# EAGLE design RPiLPC1114FDH28 (EAGLE 7.5.0)
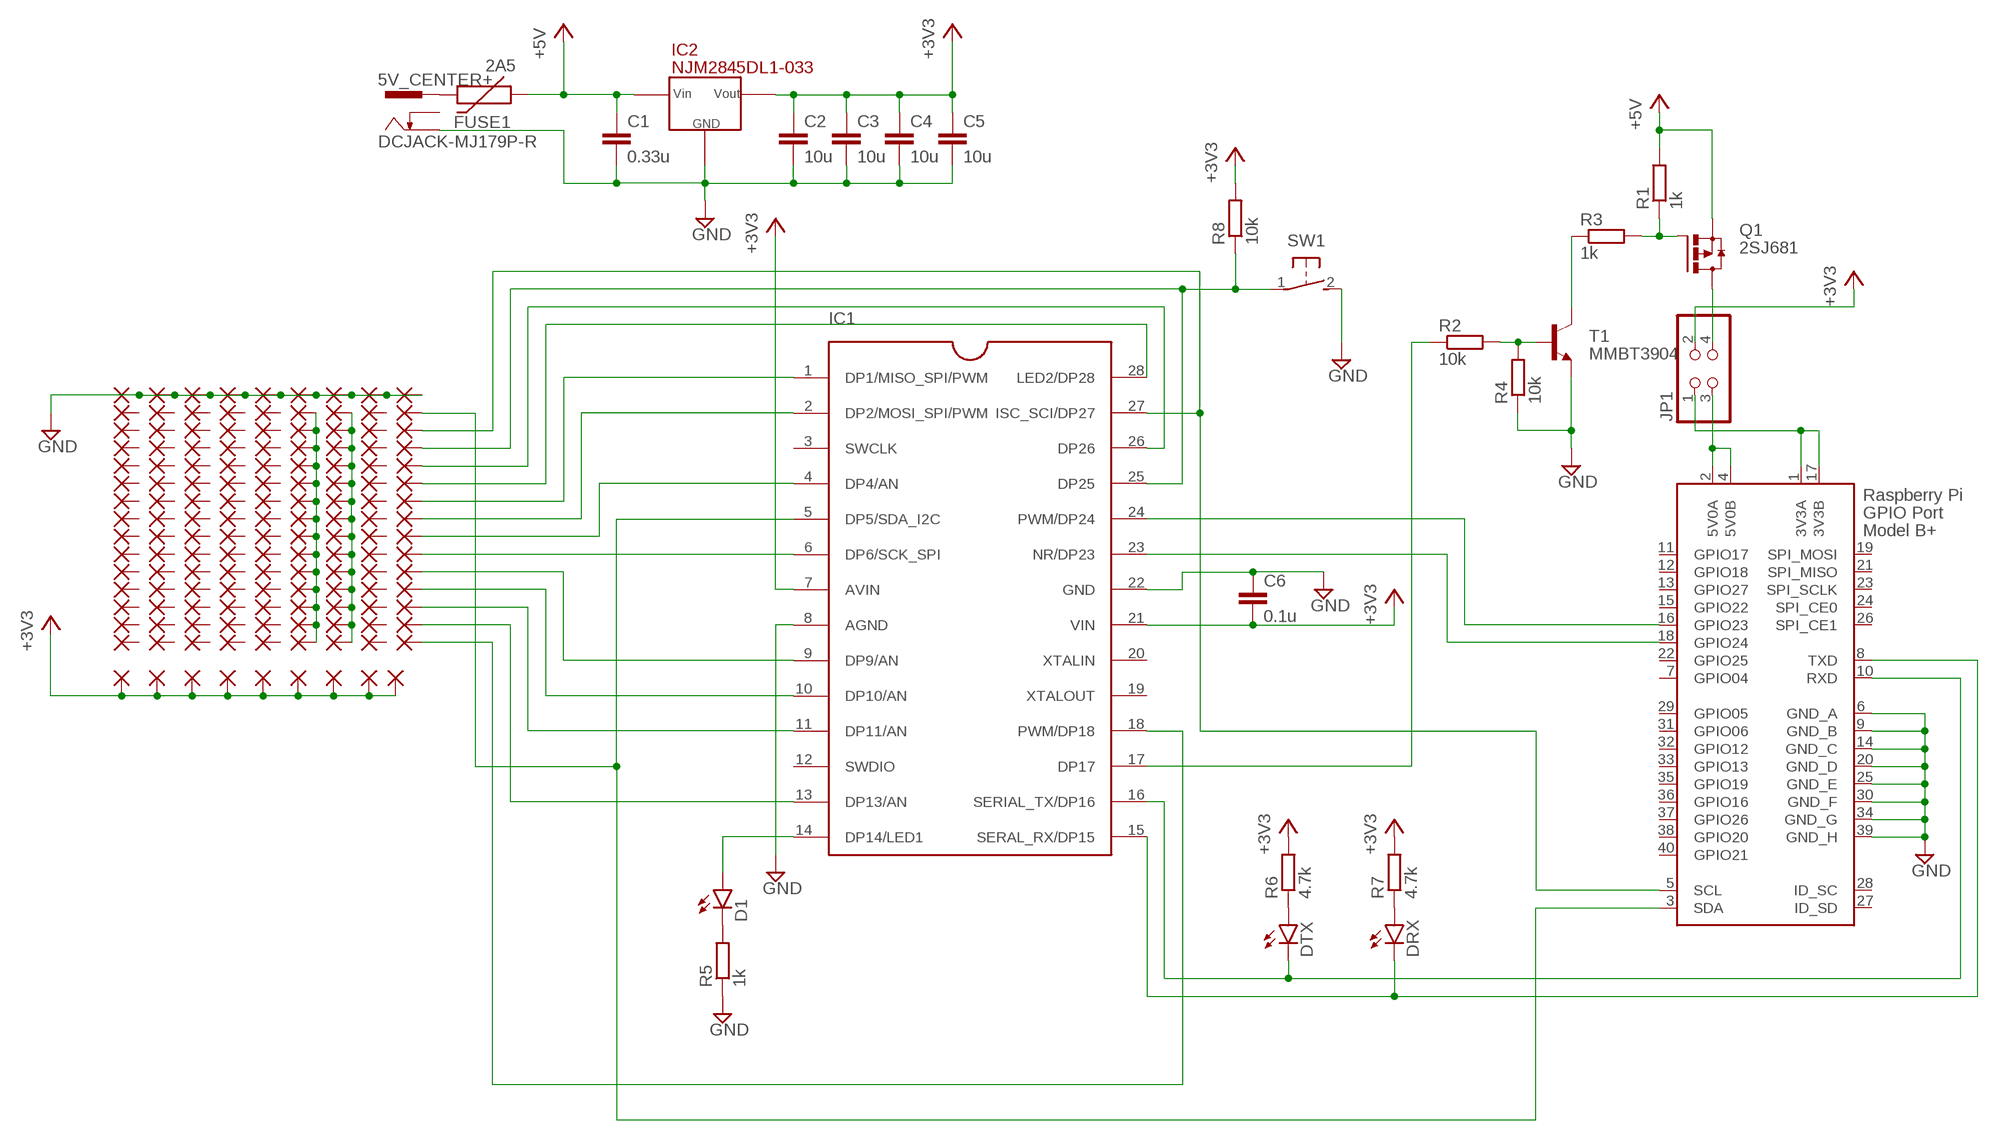
[diagram p0: schematic, sheet 1]

## Parts
5V_CENTER+  DCJACK-MJ179P-R  [MJ-179P-R]
C1  0.33u  C-EUC0603  [C0603]
C2  10u  C-EUC0805  [C0805]
C3  10u  C-EUC0805  [C0805]
C4  10u  C-EUC0805  [C0805]
C5  10u  C-EUC0805  [C0805]
C6  0.1u  C-EUC0603  [C0603]
D1  LED0603  [LED-0603]
DRX  LED0603  [LED-0603]
DTX  LED0603  [LED-0603]
FUSE1  2A5  PTCPTH  [PTC]
IC1  LPC1114DH28  [TSSOP28]
IC2  NJM2845DL1-033  NJM2845DL1  [TO-252-3]
JP1  PINHD-2X2  [2X02]
PAD1  WIREPAD1,6/0,8  [1,6/0,8]
PAD2  WIREPAD1,6/0,8  [1,6/0,8]
PAD3  WIREPAD1,6/0,8  [1,6/0,8]
PAD4  WIREPAD1,6/0,8  [1,6/0,8]
PAD5  WIREPAD1,6/0,8  [1,6/0,8]
PAD6  WIREPAD1,6/0,8  [1,6/0,8]
PAD7  WIREPAD1,6/0,8  [1,6/0,8]
PAD8  WIREPAD1,6/0,8  [1,6/0,8]
PAD9  WIREPAD1,6/0,8  [1,6/0,8]
PAD10  WIREPAD1,6/0,8  [1,6/0,8]
PAD11  WIREPAD1,6/0,8  [1,6/0,8]
PAD12  WIREPAD1,6/0,8  [1,6/0,8]
PAD13  WIREPAD1,6/0,8  [1,6/0,8]
PAD14  WIREPAD1,6/0,8  [1,6/0,8]
PAD15  WIREPAD1,6/0,8  [1,6/0,8]
PAD16  WIREPAD1,6/0,8  [1,6/0,8]
PAD17  WIREPAD1,6/0,8  [1,6/0,8]
PAD18  WIREPAD1,6/0,8  [1,6/0,8]
PAD19  WIREPAD1,6/0,8  [1,6/0,8]
PAD20  WIREPAD1,6/0,8  [1,6/0,8]
PAD21  WIREPAD1,6/0,8  [1,6/0,8]
PAD22  WIREPAD1,6/0,8  [1,6/0,8]
PAD23  WIREPAD1,6/0,8  [1,6/0,8]
PAD24  WIREPAD1,6/0,8  [1,6/0,8]
PAD25  WIREPAD1,6/0,8  [1,6/0,8]
PAD26  WIREPAD1,6/0,8  [1,6/0,8]
PAD27  WIREPAD1,6/0,8  [1,6/0,8]
PAD28  WIREPAD1,6/0,8  [1,6/0,8]
PAD29  WIREPAD1,6/0,8  [1,6/0,8]
PAD30  WIREPAD1,6/0,8  [1,6/0,8]
PAD31  WIREPAD1,6/0,8  [1,6/0,8]
PAD32  WIREPAD1,6/0,8  [1,6/0,8]
PAD33  WIREPAD1,6/0,8  [1,6/0,8]
PAD34  WIREPAD1,6/0,8  [1,6/0,8]
PAD35  WIREPAD1,6/0,8  [1,6/0,8]
PAD36  WIREPAD1,6/0,8  [1,6/0,8]
PAD37  WIREPAD1,6/0,8  [1,6/0,8]
PAD38  WIREPAD1,6/0,8  [1,6/0,8]
PAD39  WIREPAD1,6/0,8  [1,6/0,8]
PAD40  WIREPAD1,6/0,8  [1,6/0,8]
PAD41  WIREPAD1,6/0,8  [1,6/0,8]
PAD42  WIREPAD1,6/0,8  [1,6/0,8]
PAD43  WIREPAD1,6/0,8  [1,6/0,8]
PAD44  WIREPAD1,6/0,8  [1,6/0,8]
PAD45  WIREPAD1,6/0,8  [1,6/0,8]
PAD46  WIREPAD1,6/0,8  [1,6/0,8]
PAD47  WIREPAD1,6/0,8  [1,6/0,8]
PAD48  WIREPAD1,6/0,8  [1,6/0,8]
PAD49  WIREPAD1,6/0,8  [1,6/0,8]
PAD50  WIREPAD1,6/0,8  [1,6/0,8]
PAD51  WIREPAD1,6/0,8  [1,6/0,8]
PAD53  WIREPAD1,6/0,8  [1,6/0,8]
PAD54  WIREPAD1,6/0,8  [1,6/0,8]
PAD55  WIREPAD1,6/0,8  [1,6/0,8]
PAD56  WIREPAD1,6/0,8  [1,6/0,8]
PAD57  WIREPAD1,6/0,8  [1,6/0,8]
PAD58  WIREPAD1,6/0,8  [1,6/0,8]
PAD59  WIREPAD1,6/0,8  [1,6/0,8]
PAD60  WIREPAD1,6/0,8  [1,6/0,8]
PAD61  WIREPAD1,6/0,8  [1,6/0,8]
PAD62  WIREPAD1,6/0,8  [1,6/0,8]
PAD63  WIREPAD1,6/0,8  [1,6/0,8]
PAD64  WIREPAD1,6/0,8  [1,6/0,8]
PAD65  WIREPAD1,6/0,8  [1,6/0,8]
PAD66  WIREPAD1,6/0,8  [1,6/0,8]
PAD67  WIREPAD1,6/0,8  [1,6/0,8]
PAD69  WIREPAD1,6/0,8  [1,6/0,8]
PAD70  WIREPAD1,6/0,8  [1,6/0,8]
PAD71  WIREPAD1,6/0,8  [1,6/0,8]
PAD72  WIREPAD1,6/0,8  [1,6/0,8]
PAD73  WIREPAD1,6/0,8  [1,6/0,8]
PAD74  WIREPAD1,6/0,8  [1,6/0,8]
PAD75  WIREPAD1,6/0,8  [1,6/0,8]
PAD76  WIREPAD1,6/0,8  [1,6/0,8]
PAD77  WIREPAD1,6/0,8  [1,6/0,8]
PAD78  WIREPAD1,6/0,8  [1,6/0,8]
PAD79  WIREPAD1,6/0,8  [1,6/0,8]
PAD80  WIREPAD1,6/0,8  [1,6/0,8]
PAD81  WIREPAD1,6/0,8  [1,6/0,8]
PAD82  WIREPAD1,6/0,8  [1,6/0,8]
PAD83  WIREPAD1,6/0,8  [1,6/0,8]
PAD100  WIREPAD1,6/0,8  [1,6/0,8]
PAD101  WIREPAD1,6/0,8  [1,6/0,8]
PAD102  WIREPAD1,6/0,8  [1,6/0,8]
PAD103  WIREPAD1,6/0,8  [1,6/0,8]
PAD104  WIREPAD1,6/0,8  [1,6/0,8]
PAD105  WIREPAD1,6/0,8  [1,6/0,8]
PAD106  WIREPAD1,6/0,8  [1,6/0,8]
PAD107  WIREPAD1,6/0,8  [1,6/0,8]
PAD108  WIREPAD1,6/0,8  [1,6/0,8]
PAD109  WIREPAD1,6/0,8  [1,6/0,8]
PAD110  WIREPAD1,6/0,8  [1,6/0,8]
PAD112  WIREPAD1,6/0,8  [1,6/0,8]
PAD113  WIREPAD1,6/0,8  [1,6/0,8]
PAD114  WIREPAD1,6/0,8  [1,6/0,8]
PAD115  WIREPAD1,6/0,8  [1,6/0,8]
PAD117  WIREPAD1,6/0,8  [1,6/0,8]
PAD118  WIREPAD1,6/0,8  [1,6/0,8]
PAD119  WIREPAD1,6/0,8  [1,6/0,8]
PAD120  WIREPAD1,6/0,8  [1,6/0,8]
PAD121  WIREPAD1,6/0,8  [1,6/0,8]
PAD122  WIREPAD1,6/0,8  [1,6/0,8]
PAD123  WIREPAD1,6/0,8  [1,6/0,8]
PAD124  WIREPAD1,6/0,8  [1,6/0,8]
PAD126  WIREPAD1,6/0,8  [1,6/0,8]
PAD127  WIREPAD1,6/0,8  [1,6/0,8]
PAD128  WIREPAD1,6/0,8  [1,6/0,8]
PAD129  WIREPAD1,6/0,8  [1,6/0,8]
PAD130  WIREPAD1,6/0,8  [1,6/0,8]
PAD131  WIREPAD1,6/0,8  [1,6/0,8]
PAD133  WIREPAD1,6/0,8  [1,6/0,8]
PAD134  WIREPAD1,6/0,8  [1,6/0,8]
PAD135  WIREPAD1,6/0,8  [1,6/0,8]
PAD136  WIREPAD1,6/0,8  [1,6/0,8]
PAD137  WIREPAD1,6/0,8  [1,6/0,8]
PAD138  WIREPAD1,6/0,8  [1,6/0,8]
PAD140  WIREPAD1,6/0,8  [1,6/0,8]
PAD141  WIREPAD1,6/0,8  [1,6/0,8]
PAD142  WIREPAD1,6/0,8  [1,6/0,8]
PAD143  WIREPAD1,6/0,8  [1,6/0,8]
PAD144  WIREPAD1,6/0,8  [1,6/0,8]
PAD145  WIREPAD1,6/0,8  [1,6/0,8]
PAD147  WIREPAD1,6/0,8  [1,6/0,8]
PAD148  WIREPAD1,6/0,8  [1,6/0,8]
PAD149  WIREPAD1,6/0,8  [1,6/0,8]
PAD150  WIREPAD1,6/0,8  [1,6/0,8]
PAD151  WIREPAD1,6/0,8  [1,6/0,8]
PAD152  WIREPAD1,6/0,8  [1,6/0,8]
PAD-3V3  WIREPAD1,6/0,8  [1,6/0,8]
PAD-DP1  WIREPAD1,6/0,8  [1,6/0,8]
PAD-DP2  WIREPAD1,6/0,8  [1,6/0,8]
PAD-DP4  WIREPAD1,6/0,8  [1,6/0,8]
PAD-DP5/SDA  WIREPAD1,6/0,8  [1,6/0,8]
PAD-DP6  WIREPAD1,6/0,8  [1,6/0,8]
PAD-DP9  WIREPAD1,6/0,8  [1,6/0,8]
PAD-DP10  WIREPAD1,6/0,8  [1,6/0,8]
PAD-DP11  WIREPAD1,6/0,8  [1,6/0,8]
PAD-DP13  WIREPAD1,6/0,8  [1,6/0,8]
PAD-DP18  WIREPAD1,6/0,8  [1,6/0,8]
PAD-DP25  WIREPAD1,6/0,8  [1,6/0,8]
PAD-DP26  WIREPAD1,6/0,8  [1,6/0,8]
PAD-DP27/SCL  WIREPAD1,6/0,8  [1,6/0,8]
PAD-DP28  WIREPAD1,6/0,8  [1,6/0,8]
PAD_GND  WIREPAD1,6/0,8  [1,6/0,8]
Q1  2SJ681  [2-7J2B(TOSHIBA)]
R1  1k  R-EU_R0603  [R0603]
R2  10k  R-EU_R0603  [R0603]
R3  1k  R-EU_R0603  [R0603]
R4  10k  R-EU_R0603  [R0603]
R5  1k  R-EU_R0603  [R0603]
R6  4.7k  R-EU_R0603  [R0603]
R7  4.7k  R-EU_R0603  [R0603]
R8  10k  R-EU_R0603  [R0603]
SW1  SWITCH-TACTILESW  [SWITCH-TACTILE]
T1  MMBT3904  TRANSISTOR_NPNMMBT2222A  [SOT23-3]
X1  RASPI_GPIO_B+#_PIN  [RASPI_GPIO_B+_PIN]

## Nets
+3V3 [3V3]: C2.1 C3.1 C4.1 C5.1 C6.2 IC1.7(AVIN) IC1.21(VIN) IC2.VOUT JP1.2 PAD117.1(P) PAD118.1(P) PAD119.1(P) PAD120.1(P) PAD121.1(P) PAD122.1(P) PAD123.1(P) PAD124.1(P) PAD-3V3.1(P) R6.2 R7.2 R8.2
+5V [5V]: C1.1 FUSE1.P$1 IC2.VIN Q1.P$3(S) R1.2
GND [GND]: 5V_CENTER+.2 C1.2 C2.2 C3.2 C4.2 C5.2 C6.1 IC1.8(AGND) IC1.22(GND) IC2.GND PAD1.1(P) PAD10.1(P) PAD19.1(P) PAD28.1(P) PAD37.1(P) PAD53.1(P) PAD69.1(P) PAD100.1(P) PAD_GND.1(P) R4.1 R5.1 SW1.2 T1.2(E) X1.6(GND_A) X1.9(GND_B) X1.14(GND_C) X1.20(GND_D) X1.25(GND_E) X1.30(GND_F) X1.34(GND_G) X1.39(GND_H)
N$1: DRX.C IC1.15(SERAL_RX/DP15) X1.8(TXD)
N$2: IC1.2(DP2/MOSI_SPI/PWM) PAD-DP2.1(P)
N$3: IC1.5(DP5/SDA_I2C) PAD-DP5/SDA.1(P) X1.3(SDA)
N$4: IC1.27(ISC_SCI/DP27) PAD-DP27/SCL.1(P) X1.5(SCL)
N$5: R2.2 R4.2 T1.1(B)
N$6: R3.1 T1.3(C)
N$7: Q1.P$1(G) R1.1 R3.2
N$8 [TORPI]: JP1.3 X1.2(5V0A) X1.4(5V0B)
N$9 [5V]: 5V_CENTER+.1 FUSE1.P$2
N$10: IC1.23(NR/DP23) X1.18(GPIO24)
N$11: IC1.24(PWM/DP24) X1.16(GPIO23)
N$12: IC1.17(DP17) R2.1
N$13: D1.C R5.2
N$14: D1.A IC1.14(DP14/LED1)
N$15: DTX.A R6.1
N$16: DRX.A R7.1
N$17: DTX.C IC1.16(SERIAL_TX/DP16) X1.10(RXD)
N$18: IC1.1(DP1/MISO_SPI/PWM) PAD-DP1.1(P)
N$19: IC1.4(DP4/AN) PAD-DP4.1(P)
N$20: IC1.6(DP6/SCK_SPI) PAD-DP6.1(P)
N$21: IC1.13(DP13/AN) PAD-DP13.1(P)
N$22: IC1.11(DP11/AN) PAD-DP11.1(P)
N$23: IC1.10(DP10/AN) PAD-DP10.1(P)
N$24: IC1.9(DP9/AN) PAD-DP9.1(P)
N$25: IC1.18(PWM/DP18) PAD-DP18.1(P)
N$26: IC1.28(LED2/DP28) PAD-DP28.1(P)
N$27: IC1.26(DP26) PAD-DP26.1(P)
N$28: IC1.25(DP25) PAD-DP25.1(P) R8.1 SW1.1
N$29 [3V3]: JP1.1 X1.1(3V3A) X1.17(3V3B)
N$30 [TORPI]: JP1.4 Q1.P$2(D)
N$31: PAD54.1(P) PAD55.1(P) PAD56.1(P) PAD57.1(P) PAD58.1(P) PAD59.1(P) PAD60.1(P) PAD61.1(P) PAD62.1(P) PAD63.1(P) PAD64.1(P) PAD65.1(P) PAD66.1(P) PAD67.1(P)
N$32: PAD70.1(P) PAD71.1(P) PAD72.1(P) PAD73.1(P) PAD74.1(P) PAD75.1(P) PAD76.1(P) PAD77.1(P) PAD78.1(P) PAD79.1(P) PAD80.1(P) PAD81.1(P) PAD82.1(P) PAD83.1(P)
Unconnected: 5V_CENTER+.3 IC1.3(SWCLK) IC1.12(SWDIO) IC1.19(XTALOUT) IC1.20(XTALIN) PAD2.1(P) PAD3.1(P) PAD4.1(P) PAD5.1(P) PAD6.1(P) PAD7.1(P) PAD8.1(P) PAD9.1(P) PAD11.1(P) PAD12.1(P) PAD13.1(P) PAD14.1(P) PAD15.1(P) PAD16.1(P) PAD17.1(P) PAD18.1(P) PAD20.1(P) PAD21.1(P) PAD22.1(P) PAD23.1(P) PAD24.1(P) PAD25.1(P) PAD26.1(P) PAD27.1(P) PAD29.1(P) PAD30.1(P) PAD31.1(P) PAD32.1(P) PAD33.1(P) PAD34.1(P) PAD35.1(P) PAD36.1(P) PAD38.1(P) PAD39.1(P) PAD40.1(P) PAD41.1(P) PAD42.1(P) PAD43.1(P) PAD44.1(P) PAD45.1(P) PAD46.1(P) PAD47.1(P) PAD48.1(P) PAD49.1(P) PAD50.1(P) PAD51.1(P) PAD101.1(P) PAD102.1(P) PAD103.1(P) PAD104.1(P) PAD105.1(P) PAD106.1(P) PAD107.1(P) PAD108.1(P) PAD109.1(P) PAD110.1(P) PAD112.1(P) PAD113.1(P) PAD114.1(P) PAD115.1(P) PAD126.1(P) PAD127.1(P) PAD128.1(P) PAD129.1(P) PAD130.1(P) PAD131.1(P) PAD133.1(P) PAD134.1(P) PAD135.1(P) PAD136.1(P) PAD137.1(P) PAD138.1(P) PAD140.1(P) PAD141.1(P) PAD142.1(P) PAD143.1(P) PAD144.1(P) PAD145.1(P) PAD147.1(P) PAD148.1(P) PAD149.1(P) PAD150.1(P) PAD151.1(P) PAD152.1(P) X1.7(GPIO04) X1.11(GPIO17) X1.12(GPIO18) X1.13(GPIO27) X1.15(GPIO22) X1.19(SPI_MOSI) X1.21(SPI_MISO) X1.22(GPIO25) X1.23(SPI_SCLK) X1.24(SPI_CE0) X1.26(SPI_CE1) X1.27(ID_SD) X1.28(ID_SC) X1.29(GPIO05) X1.31(GPIO06) X1.32(GPIO12) X1.33(GPIO13) X1.35(GPIO19) X1.36(GPIO16) X1.37(GPIO26) X1.38(GPIO20) X1.40(GPIO21)

## Library data of the parts
5V_CENTER+ = kamiki-dcjack:DCJACK: DC JACK 2.1mmφ - 5.5mmφ DCジャック、基板用。
C1-C6 = resistor:C-EU: CAPACITOR, European symbol
D1 DRX DTX = SparkFun-LED:LED: LEDs Standard schematic elements and footprints for 5mm, 3mm, 1206, and 0603 sized LEDs. 5mm - Spark Fun Electronics SKU : COM-00529 (and others)
FUSE1 = SparkFun-PowerIC:PTC: Resettable Fuse PTC Resettable Fuse. Spark Fun Electronics SKU : COM-08357
IC1 = lpc1114fn28:LPC1114DH28
IC2 = NJM2845DL1:NJM2845DL1: New JRC NJM2845DL1 LDO Three-terminal regulator.
JP1 = pinhead:PINHD-2X2: PIN HEADER
PAD1-PAD51 PAD53-PAD67 PAD69-PAD83 PAD100-PAD110 PAD112-PAD115 PAD117-PAD124 PAD126-PAD131 PAD133-PAD138 PAD140-PAD145 PAD147-PAD152 PAD-3V3 PAD-DP1 PAD-DP2 PAD-DP4 PAD-DP5/SDA PAD-DP6 PAD-DP9-PAD-DP11 PAD-DP13 PAD-DP18 PAD-DP25 PAD-DP26 PAD-DP27/SCL PAD-DP28 PAD_GND = wirepad:WIREPAD: Wire PAD connect wire on PCB
Q1 = mosfet:2SJ681
R1-R8 = resistor:R-EU_: RESISTOR, European symbol
SW1 = tact-switch-2p:SWITCH-TACTILE: tactile switch - 2p
T1 = SparkFun-DiscreteSemi:TRANSISTOR_NPN: Generic NPN BJT MMBT2222A - TRANS-08049 (SOT-23, 1A 40V) MPSA42 - TRANS-09116 (SOT-23, 500mA 300V) MMBT5088LT1G - TRANS-11160 (SOT-23, 50 mA 30V) BC547 - COM-08928 <http://www.sparkfun.com/products/8928> (TO-92 45V 100mA) (1.Collector 2.Base 3.Emitter) 2N3904 - COM-00521 <http://www.sparkfun.com/products/521> (TO-92 40V 200mA) (1.Emitter 2.Base 3.Collector) P2N2222A - COM-12852 <http://www.sparkfun.com/products/12852> (TO-92 40V 600mA) (1.Collector 2.Base 3.Emitter); PROD_ID: TRANS-08049; VALUE: MMBT2222A
X1 = raspberrypi_bastelstube_v13:RASPI_GPIO_B+#: 2x20 header connector, all pins connected

## Net classes
0 default: width 0.305 mm
1 GND: width 1.524 mm
2 3V3: width 0.406 mm
3 5V: width 1.524 mm
4 TORPI: width 1.524 mm

## Board
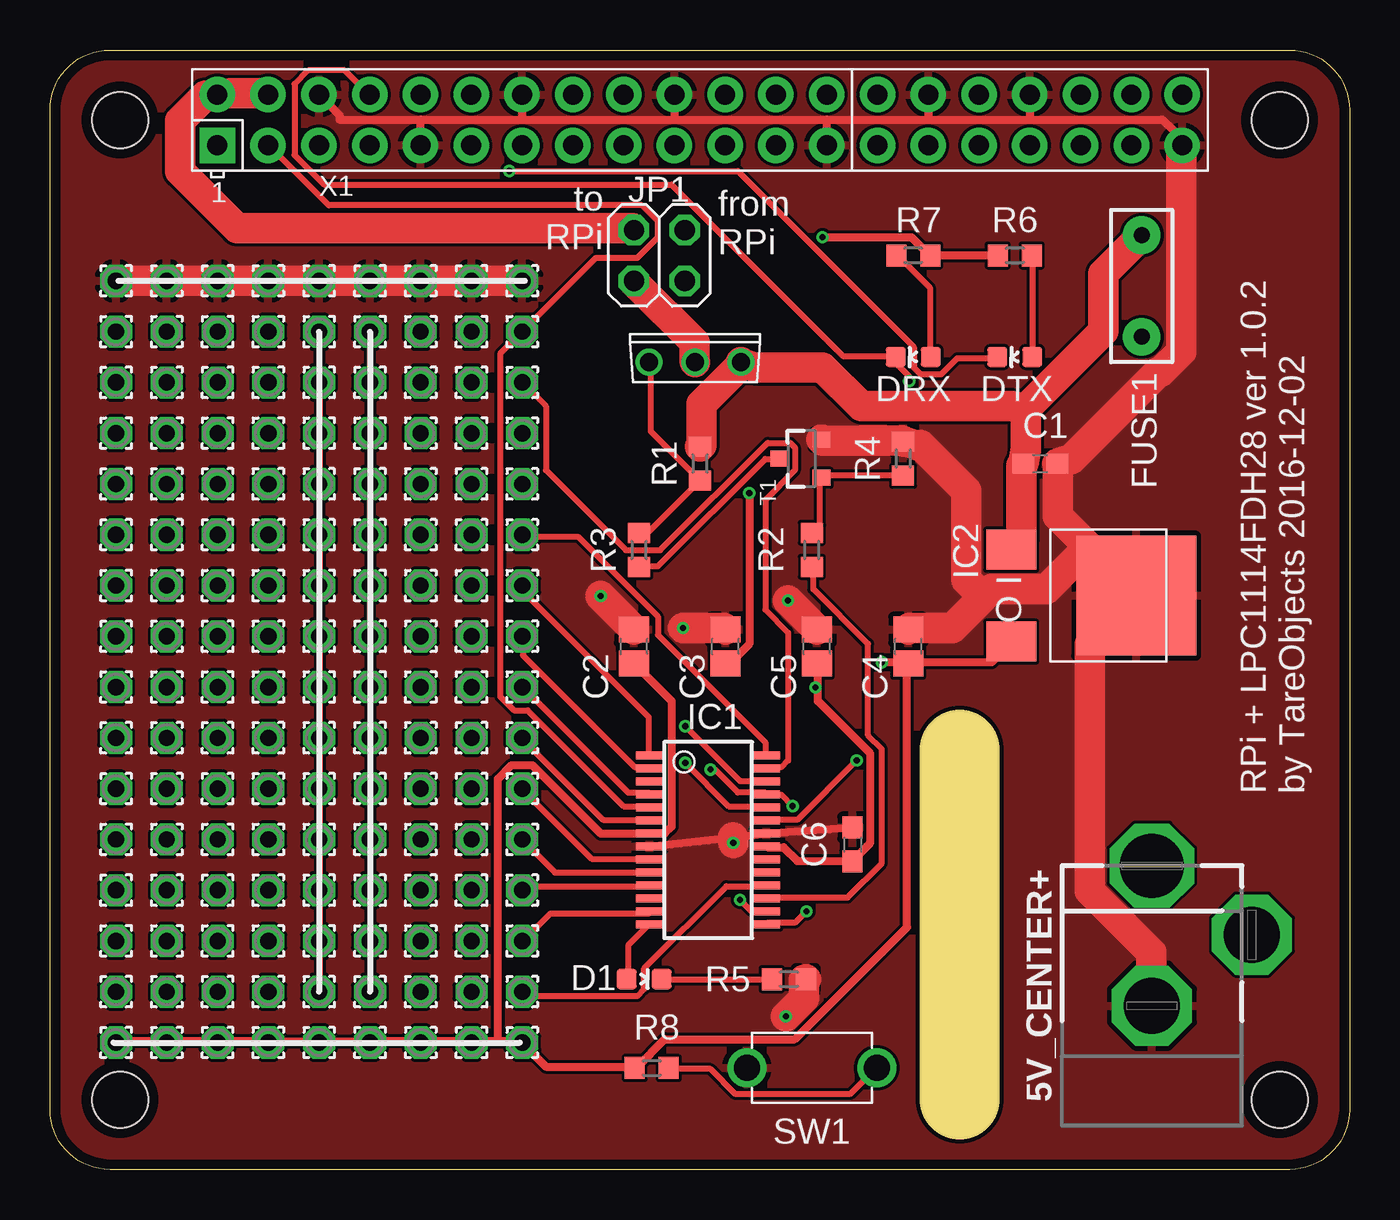
[diagram p1: board, top side]
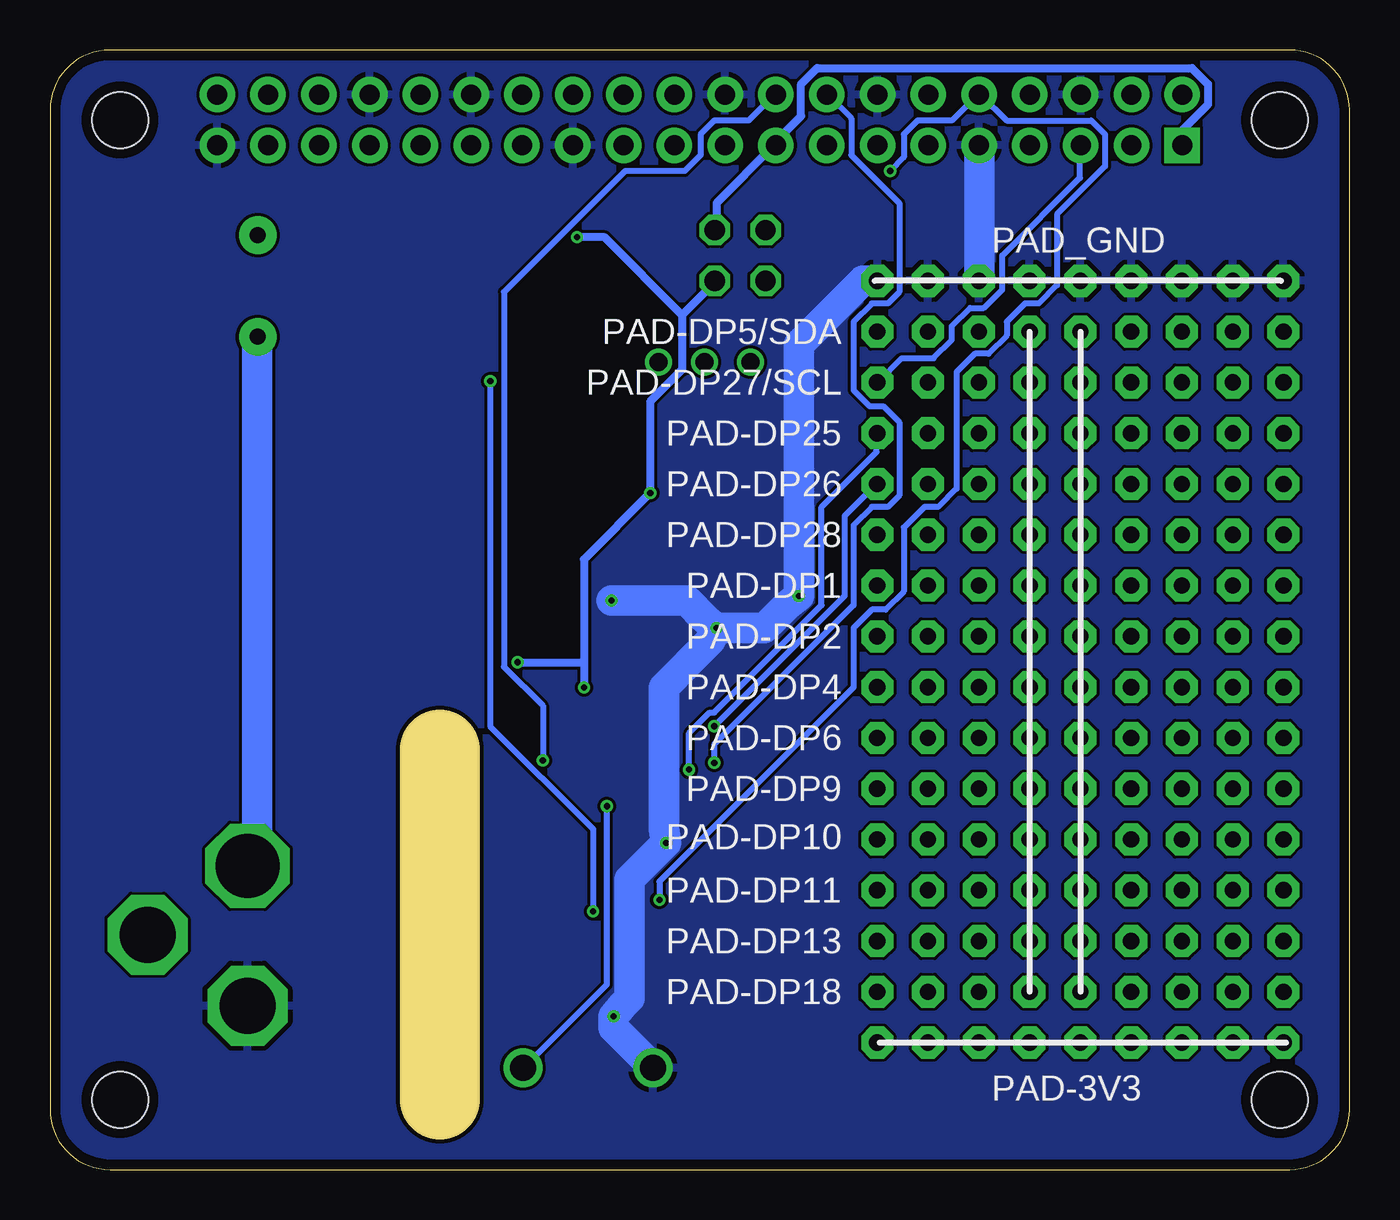
[diagram p2: board, bottom side, seen from below]

Size 65 x 56 mm. Coordinates in mm from the lower left corner, seen from the top.
Outline: 0,3 0,53 arc-90 3,56 62,56 arc-90 65,53 65,3 arc-90 62,0 3,0 arc-90 0,3
Copper layers (1*16): Top 0.035mm / dielectric 1.6mm / Bottom 0.035mm
Design rules "Elecrow_2-layer_PCB_eagle_rule": minimum track width 6mil, minimum drill 12mil, track to track 6mil, track to pad 6mil, pad to pad 6mil, via to via 8mil, smd to smd 0mil, copper to edge 20mil, drill to drill 10mil, minimum pad ring 6mil, minimum via ring 6mil, stop-mask expansion 0mil, vias tented up to drill 100mil, thermal gap 10mil
Holes 2.8 mm at 3.5,52.5 3.5,3.5 61.5,3.5 61.5,52.5
tRestrict: 1 lines
bRestrict: 1 lines
Milling: 1 lines

### Footprints (pad centres in the part's own frame; a part is rotated, then mirrored left to right if it is on the bottom)
MJ-179P-R = drill 3.2 pad 4 octagon: 1 3,0 | drill 2.8 pad 4 octagon: 2 -4,0; 3 -0.45,-5
C0603 = smd 1.1 x 1: 1 -0.85,0; 2 0.85,0
C0805 = smd 1.3 x 1.5: 1 -0.85,0; 2 0.85,0
LED-0603 = smd 1 x 1: A 0,-0.877; C 0,0.877
PTC = drill 0.8 pad 1.88: P$1 -2.54,0; P$2 2.54,0
TSSOP28 = smd 0.4 x 1.35: 1 -4.195,-3.025; 2 -3.545,-3.025; 3 -2.895,-3.025; 4 -2.245,-3.025; 5 -1.595,-3.025; 6 -0.945,-3.025; 7 -0.295,-3.025; 8 0.355,-3.025; 9 1.005,-3.025; 10 1.655,-3.025; 11 2.305,-3.025; 12 2.955,-3.025; 13 3.605,-3.025; 14 4.255,-3.025; 15 4.255,2.825; 16 3.605,2.825; 17 2.955,2.825; 18 2.305,2.825; 19 1.655,2.825; 20 1.005,2.825; 21 0.355,2.825; 22 -0.295,2.825; 23 -0.945,2.825; 24 -1.595,2.825; 25 -2.245,2.825; 26 -2.895,2.825; 27 -3.545,2.825; 28 -4.195,2.825
TO-252-3 = smd 6 x 6: GND 0,1.5 | smd 2 x 2.5: VIN -2.3,-4.75; VOUT 2.3,-4.75
2X02 = drill 1.016 octagon: 1 -1.27,-1.27; 2 -1.27,1.27; 3 1.27,-1.27; 4 1.27,1.27
1,6/0,8 = drill 0.813 pad 1.6 octagon: 1 0,0
2-7J2B(TOSHIBA) = drill 0.9: P$1 -2.3,0; P$2 0,0; P$3 2.3,0
R0603 = smd 1 x 1.1: 1 -0.85,0; 2 0.85,0
SWITCH-TACTILE = drill 1.3: 1 -3.25,0; 2 3.25,0
SOT23-3 = smd 0.8 x 0.9: 1 -0.95,-1; 2 0.95,-1; 3 0,1.1
RASPI_GPIO_B+_PIN = drill 1 pad 1.778 square: 1 -24.13,-1.27 | drill 1 pad 1.778: 2 -24.13,1.27; 3 -21.59,-1.27; 4 -21.59,1.27; 5 -19.05,-1.27; 6 -19.05,1.27; 7 -16.51,-1.27; 8 -16.51,1.27; 9 -13.97,-1.27; 10 -13.97,1.27; 11 -11.43,-1.27; 12 -11.43,1.27; 13 -8.89,-1.27; 14 -8.89,1.27; 15 -6.35,-1.27; 16 -6.35,1.27; 17 -3.81,-1.27; 18 -3.81,1.27; 19 -1.27,-1.27; 20 -1.27,1.27; 21 1.27,-1.27; 22 1.27,1.27; 23 3.81,-1.27; 24 3.81,1.27; 25 6.35,-1.27; 26 6.35,1.27; 27 8.89,-1.27; 28 8.89,1.27; 29 11.43,-1.27; 30 11.43,1.27; 31 13.97,-1.27; 32 13.97,1.27; 33 16.51,-1.27; 34 16.51,1.27; 35 19.05,-1.27; 36 19.05,1.27; 37 21.59,-1.27; 38 21.59,1.27; 39 24.13,-1.27; 40 24.13,1.27

### Placement (x,y rotation side)
5V_CENTER+  55.12,12.19 90 top
C1  49.53,35.31 0 top
C2  29.21,26.16 90 top
C3  33.78,26.16 90 top
C4  42.93,26.16 90 top
C5  38.35,26.16 90 top
C6  40.13,16.26 270 top
D1  29.72,9.53 270 top
DRX  43.18,40.64 90 top
DTX  48.26,40.64 90 top
FUSE1  54.61,44.2 270 top
IC1  33.02,16.51 270 top
IC2  52.83,28.7 270 top
JP1  30.48,45.72 180 top
PAD1  3.3,44.45 0 top
PAD2  3.3,41.91 0 top
PAD3  3.3,39.37 0 top
PAD4  3.3,36.83 0 top
PAD5  3.3,34.29 0 top
PAD6  3.3,31.75 0 top
PAD7  3.3,29.21 0 top
PAD8  3.3,26.67 0 top
PAD9  3.3,24.13 0 top
PAD10  5.84,44.45 0 top
PAD11  5.84,41.91 0 top
PAD12  5.84,39.37 0 top
PAD13  5.84,36.83 0 top
PAD14  5.84,34.29 0 top
PAD15  5.84,31.75 0 top
PAD16  5.84,29.21 0 top
PAD17  5.84,26.67 0 top
PAD18  5.84,24.13 0 top
PAD19  8.38,44.45 0 top
PAD20  8.38,41.91 0 top
PAD21  8.38,39.37 0 top
PAD22  8.38,36.83 0 top
PAD23  8.38,34.29 0 top
PAD24  8.38,31.75 0 top
PAD25  8.38,29.21 0 top
PAD26  8.38,26.67 0 top
PAD27  8.38,24.13 0 top
PAD28  10.92,44.45 0 top
PAD29  10.92,41.91 0 top
PAD30  10.92,39.37 0 top
PAD31  10.92,36.83 0 top
PAD32  10.92,34.29 0 top
PAD33  10.92,31.75 0 top
PAD34  10.92,29.21 0 top
PAD35  10.92,26.67 0 top
PAD36  10.92,24.13 0 top
PAD37  13.46,44.45 0 top
PAD38  18.54,41.91 0 top
PAD39  18.54,39.37 0 top
PAD40  18.54,36.83 0 top
PAD41  18.54,34.29 0 top
PAD42  18.54,31.75 0 top
PAD43  18.54,29.21 0 top
PAD44  18.54,26.67 0 top
PAD45  18.54,24.13 0 top
PAD46  18.54,21.59 0 top
PAD47  18.54,19.05 0 top
PAD48  18.54,16.51 0 top
PAD49  18.54,13.97 0 top
PAD50  18.54,11.43 0 top
PAD51  18.54,8.89 0 top
PAD53  16,44.45 0 top
PAD54  13.46,41.91 0 top
PAD55  13.46,39.37 0 top
PAD56  13.46,36.83 0 top
PAD57  13.46,34.29 0 top
PAD58  13.46,31.75 0 top
PAD59  13.46,29.21 0 top
PAD60  13.46,26.67 0 top
PAD61  13.46,24.13 0 top
PAD62  13.46,21.59 0 top
PAD63  13.46,19.05 0 top
PAD64  13.46,16.51 0 top
PAD65  13.46,13.97 0 top
PAD66  13.46,11.43 0 top
PAD67  13.46,8.89 0 top
PAD69  18.54,44.45 0 top
PAD70  16,41.91 0 top
PAD71  16,39.37 0 top
PAD72  16,36.83 0 top
PAD73  16,34.29 0 top
PAD74  16,31.75 0 top
PAD75  16,29.21 0 top
PAD76  16,26.67 0 top
PAD77  16,24.13 0 top
PAD78  16,21.59 0 top
PAD79  16,19.05 0 top
PAD80  16,16.51 0 top
PAD81  16,13.97 0 top
PAD82  16,11.43 0 top
PAD83  16,8.89 0 top
PAD100  21.08,44.45 0 top
PAD101  21.08,41.91 0 top
PAD102  21.08,39.37 0 top
PAD103  21.08,36.83 0 top
PAD104  21.08,34.29 0 top
PAD105  21.08,31.75 0 top
PAD106  21.08,29.21 0 top
PAD107  21.08,26.67 0 top
PAD108  21.08,24.13 0 top
PAD109  21.08,21.59 0 top
PAD110  21.08,19.05 0 top
PAD112  21.08,16.51 0 top
PAD113  21.08,13.97 0 top
PAD114  21.08,11.43 0 top
PAD115  21.08,8.89 0 top
PAD117  13.46,6.35 0 top
PAD118  16,6.35 0 top
PAD119  10.92,6.35 0 top
PAD120  3.3,6.35 0 top
PAD121  21.08,6.35 0 top
PAD122  5.84,6.35 0 top
PAD123  18.54,6.35 0 top
PAD124  8.38,6.35 0 top
PAD126  3.3,21.59 0 top
PAD127  5.84,21.59 0 top
PAD128  8.38,21.59 0 top
PAD129  10.92,21.59 0 top
PAD130  5.84,19.05 0 top
PAD131  8.38,19.05 0 top
PAD133  3.3,16.51 0 top
PAD134  5.84,16.51 0 top
PAD135  8.38,16.51 0 top
PAD136  10.92,16.51 0 top
PAD137  10.92,13.97 0 top
PAD138  8.38,13.97 0 top
PAD140  3.3,13.97 0 top
PAD141  3.3,8.89 0 top
PAD142  8.38,8.89 0 top
PAD143  10.92,8.89 0 top
PAD144  8.38,11.43 0 top
PAD145  3.3,11.43 0 top
PAD147  5.84,8.89 0 top
PAD148  10.92,19.05 0 top
PAD149  10.92,11.43 0 top
PAD150  5.84,11.43 0 top
PAD151  3.3,19.05 0 top
PAD152  5.84,13.97 0 top
PAD-3V3  23.62,6.35 0 top
PAD-DP1  23.62,29.21 0 top
PAD-DP2  23.62,26.67 0 top
PAD-DP4  23.62,24.13 0 top
PAD-DP5/SDA  23.62,41.91 0 top
PAD-DP6  23.62,21.59 0 top
PAD-DP9  23.62,19.05 0 top
PAD-DP10  23.62,16.51 0 top
PAD-DP11  23.62,13.97 0 top
PAD-DP13  23.62,11.43 0 top
PAD-DP18  23.62,8.89 0 top
PAD-DP25  23.62,36.83 0 top
PAD-DP26  23.62,34.29 0 top
PAD-DP27/SCL  23.62,39.37 0 top
PAD-DP28  23.62,31.75 0 top
PAD_GND  23.62,44.45 0 top
Q1  32.26,40.39 0 top
R1  32.51,35.31 90 top
R2  38.1,30.99 90 top
R3  29.46,30.99 90 top
R4  42.67,35.56 270 top
R5  36.96,9.53 180 top
R6  48.26,45.72 180 top
R7  43.18,45.72 0 top
R8  30.1,5.08 180 top
SW1  38.1,5.08 180 top
T1  37.59,35.56 90 top
X1  32.5,52.5 0 top

### Tracks (layer width: path | path; a pad name or v marks a point on that pad's centre or on a via)
+3V3  (via drill 0.3)
  Top 0.406: IC1.21 35.89,16.12 36.69,16.12 37.38,15.43 40.12,15.43 C6.2 40.23,15.54 41.03,16.34 41.03,20.8 38.41,23.43 38.41,24.12 | 38.41,24.12 38.41,25.26 C5.1 | R6.2 R7.2 43.89,45.83 43.09,46.63 v38.63,46.63 | v34.98,33.83 34.98,26.29 34.06,25.38 33.83,25.38 C3.1 | v38.29,24.12 38.41,24.12 | PAD120.1 3.31,6.4 5.83,6.4 PAD122.1 5.94,6.4 8.23,6.4 PAD124.1 8.46,6.4 10.86,6.4 PAD119.1 11.09,6.4 13.37,6.4 PAD117.1 13.6,6.4 16,6.4 PAD118.1 16.12,6.4 18.4,6.4 PAD123.1 18.63,6.4 21.03,6.4 PAD121.1 21.26,6.4 22.4,6.4 | C2.1 29.26,25.26 31.09,23.43 31.09,17.14 30.75,16.8 30.06,16.8 IC1.7 29.83,16.8 27.55,16.8 24.12,20.23 23.09,20.23 22.4,19.55 22.4,6.4 | C4.1 42.98,25.38 47.09,25.38 48.01,26.29 IC2.VOUT | 22.4,6.4 23.43,6.4 PAD-3V3.1 23.66,6.29 24.8,5.14 29.15,5.14 R8.2 29.38,5.14 30.75,6.51 37.26,6.51 42.86,12.12 42.86,25.15 C4.1 | v41.6,25.38 42.75,25.38 C4.1
  Bottom 0.406: 33.38,42.75 33.38,40.01 34.98,38.41 v34.98,33.83 38.29,30.52 38.29,25.38 | 33.38,42.75 31.77,44.35 JP1.2 | v38.63,46.63 37.26,46.63 33.38,42.75 | 38.29,25.38 v38.29,24.12 | v41.6,25.38 38.29,25.38
+5V
  Top 1.524: 34.63,40.35 32.58,38.29 32.58,36.23 R1.2 | 34.63,40.35 Q1.P$3 | IC2.VIN 48.12,31.09 48.58,31.55 48.58,35.2 C1.1 48.81,36.01 48.81,38.06 | 48.81,38.06 52.69,41.95 52.69,44.81 54.52,46.63 FUSE1.P$1 | 34.63,40.35 35.32,40.12 38.63,40.12 40.58,38.18 48.12,38.18 48.81,38.06
GND  (via drill 0.3)
  Top 0.406: X1.6 14.48,52.74 14.48,52.51 18.54,52.51 | 18.54,52.51 23.62,52.51 | 23.62,52.51 31.24,52.51 | 31.24,52.51 38.86,52.51 | 38.86,52.51 43.94,52.51 | 43.94,52.51 49.02,52.51 | 49.02,52.51 55.63,52.51 56.63,51.57 X1.39 | X1.9 18.54,51.23 18.54,52.51 | X1.14 23.62,53.77 23.62,52.51 | X1.20 31.24,53.77 31.24,52.51 | X1.25 38.86,51.23 38.86,52.51 | X1.30 43.94,53.77 43.94,52.51 | X1.34 49.02,53.77 49.02,52.51 | IC1.8 34.16,16.62 IC1.22 C6.1
  Top 1.524: 42.63,36.46 38.63,36.46 T1.2 | 42.63,36.46 R4.1 | IC2.GND 54.29,28.8 50.41,32.69 50.41,35.2 C1.2 51.09,35.55 55.44,39.89 55.55,39.89 56.58,40.92 56.58,51.09 X1.39 | 46.69,28.63 47.09,29.03 49.84,29.03 51.44,30.63 IC2.GND | 46.69,28.63 45.15,27.09 42.98,27.09 C4.2 | 42.63,36.46 43.32,36.23 43.55,36.23 45.83,33.95 45.83,29.49 46.69,28.63 | 5V_CENTER+.2 55.09,8.23 55.09,10.86 52.01,13.95 52.01,26.29 53.84,28.12 IC2.GND | PAD1.1 3.31,44.46 5.83,44.46 PAD10.1 6.51,44.46 8.34,44.46 PAD19.1 9.14,44.46 10.86,44.46 PAD28.1 11.66,44.46 13.37,44.46 PAD37.1 14.17,44.46 16,44.46 PAD53.1 16.69,44.46 18.52,44.46 PAD69.1 19.2,44.46 21.03,44.46 PAD100.1 21.83,44.46 23.55,44.46 PAD_GND.1 | v36.8,7.66 37.72,8.57 37.72,9.49 R5.1 | v34.18,16.34 34.18,16.46 34.16,16.62 | v27.55,28.69 29.15,27.09 C2.2 | v31.66,27.09 33.72,27.09 C3.2 | v36.92,28.46 38.29,27.09 C5.2
  Bottom 1.524: SW1.2 34.86,5.14 36.8,7.09 v36.8,7.66 36.35,8.23 36.01,8.57 36.01,14.52 v34.18,16.34 34.29,17.03 34.29,24.12 32,26.4 v31.66,27.09 | PAD_GND.1 23.66,44.46 24.35,44.46 27.55,41.26 v27.55,28.69 28.12,28.23 29.26,27.09 v31.66,27.09 | v36.92,28.46 33.15,28.46 32.23,27.55 v31.66,27.09 | X1.9 18.52,51.21 18.52,44.46 PAD69.1
  pour Top: 0,0 66.04,0 66.04,55.88 0,55.88
  pour Bottom: 0,0 67.31,0 67.31,55.88 0,55.88
N$1  (via drill 0.3)
  Top 0.305: X1.8 15.89,53.84 14.74,54.98 12.92,54.98 12.23,54.29 12.23,50.75 13.72,49.26 31.09,49.26 39.66,40.69 42.29,40.69 DRX.C 42.41,40.58 42.41,40.23 42.98,39.66 v42.98,39.43 | v37.83,12.92 37.26,12.34 35.89,12.34 IC1.15
  Bottom 0.305: v37.83,12.92 37.83,17.03 42.98,22.17 v42.98,39.43
N$2
  Top 0.305: IC1.2 29.95,20.12 29.26,20.12 23.66,25.72 23.66,26.63 PAD-DP2.1
N$3
  Top 0.305: IC1.5 29.95,18.17 28.69,18.17 23.89,22.97 23.2,22.97 22.52,23.66 22.52,40.8 PAD-DP5/SDA.1 27.32,45.61 29.38,45.61 30.4,46.63 30.4,47.43 29.6,48.23 13.95,48.23 10.97,51.21 X1.3
N$4
  Top 0.305: IC1.27 35.89,20.12 36.58,20.12 36.92,20.46 36.92,26.86 35.78,28 35.78,33.49 37.26,34.98 37.26,36.12 37.03,36.35 35.89,36.35 30.52,30.98 28.8,30.98 24.8,34.98 24.8,38.18 23.66,39.32 PAD-DP27/SCL.1
  Bottom 0.305: X1.5 13.49,51.21 13.49,49.61 17.37,45.72 17.37,44.01 18.29,43.09 18.97,43.09 19.89,42.18 19.89,41.49 20.8,40.58 22.4,40.58 23.55,39.43 PAD-DP27/SCL.1
N$5
  Top 0.305: R2.2 38.18,31.89 38.52,32.23 38.52,34.52 T1.1 38.63,34.75 42.63,34.75 R4.2
N$6
  Top 0.305: T1.3 36.46,35.55 35.78,35.55 30.4,30.18 29.49,30.18 R3.1
N$7
  Top 0.305: R3.2 29.49,31.89 29.95,31.89 32.46,34.4 R1.1 32.46,34.52 30.06,36.92 30.06,40.35 Q1.P$1
N$8
  Top 1.524: JP1.3 29.15,47.09 9.37,47.09 6.51,49.95 6.51,52.46 7.77,53.72 8.34,53.72 X1.2 9.03,53.84 10.86,53.84 X1.4
N$9
  Bottom 1.524: FUSE1.P$2 54.63,41.6 54.63,15.66 55.09,15.2 5V_CENTER+.1
N$10  (via drill 0.3)
  Top 0.305: v40.35,20.46 37.38,17.49 35.89,17.49 IC1.23
  Bottom 0.305: v40.35,20.46 40.35,23.2 42.29,25.15 42.29,43.89 36.23,49.95 33.26,49.95 32.46,50.75 32.46,51.78 31.77,52.46 30.06,52.46 28.8,53.72 X1.18
N$11  (via drill 0.3)
  Top 0.305: v31.77,20.34 33.95,18.17 35.78,18.17 IC1.24
  Bottom 0.305: v31.77,20.34 31.77,21.26 24.8,28.23 24.8,32.23 23.89,33.15 23.09,33.15 22.52,33.72 22.52,37.38 23.32,38.18 24,38.18 24.8,38.98 24.8,42.41 23.89,43.32 23.09,43.32 22.52,43.89 22.52,48.35 24.92,50.75 24.92,52.58 26.06,53.72 X1.16
N$12
  Top 0.305: R2.1 38.18,30.06 38.18,29.03 40.92,26.29 40.92,21.72 41.6,21.03 41.6,15.32 39.89,13.6 35.89,13.6 IC1.17
N$13
  Top 0.305: D1.C 30.63,9.49 36.01,9.49 R5.2
N$14
  Top 0.305: D1.A 28.92,9.6 28.92,11.2 29.95,12.23 IC1.14
N$15
  Top 0.305: DTX.A 49.15,40.69 49.15,45.72 R6.1
N$16
  Top 0.305: DRX.A 44.01,40.69 44.01,44.12 42.41,45.72 R7.1
N$17  (via drill 0.3)
  Top 0.305: v22.97,49.95 34.4,49.95 43.2,41.15 43.2,40.12 43.55,39.78 44.58,39.78 45.38,40.58 47.32,40.58 DTX.C | v34.52,13.49 35.09,12.92 35.78,12.92 IC1.16
  Bottom 0.305: v22.97,49.95 22.29,50.63 22.29,51.78 21.6,52.46 19.89,52.46 18.63,53.72 X1.10 18.4,53.72 17.14,52.46 12.92,52.46 12.23,51.78 12.23,50.18 14.63,47.78 14.63,44.23 15.54,43.32 16.23,43.32 17.14,42.41 17.14,41.72 18.06,40.8 18.75,40.8 19.66,39.89 19.66,34.06 20.57,33.15 21.26,33.15 22.29,32.12 22.29,28.92 23.2,28 23.89,28 24.8,27.09 24.8,24.12 34.52,14.4 v34.52,13.49
N$18
  Top 0.305: IC1.1 29.95,20.8 29.95,22.63 23.66,28.92 23.66,29.15 PAD-DP1.1
N$19
  Top 0.305: IC1.4 29.95,18.86 28.92,18.86 23.66,24.12 PAD-DP4.1
N$20
  Top 0.305: IC1.6 29.95,17.49 27.66,17.49 23.66,21.49 PAD-DP6.1
N$21
  Top 0.305: IC1.13 29.95,12.8 25.03,12.8 23.66,11.43 PAD-DP13.1
N$22
  Top 0.305: IC1.11 29.95,14.17 23.77,14.17 23.66,14.06 PAD-DP11.1
N$23
  Top 0.305: IC1.10 29.95,14.86 25.26,14.86 23.66,16.46 PAD-DP10.1
N$24
  Top 0.305: IC1.9 29.95,15.54 27.09,15.54 23.66,18.97 PAD-DP9.1
N$25
  Top 0.305: IC1.18 35.78,14.17 33.83,14.17 29.72,10.06 29.72,9.03 29.38,8.69 23.77,8.69 23.66,8.8 PAD-DP18.1
N$26
  Top 0.305: IC1.28 35.78,20.8 35.78,21.37 30.4,26.75 30.4,27.66 26.4,31.66 23.66,31.66 PAD-DP28.1
N$27  (via drill 0.3)
  Top 0.305: v31.77,22.17 34.52,19.43 35.78,19.43 IC1.26
  Bottom 0.305: v31.77,22.17 25.26,28.69 25.26,32.69 23.66,34.29 PAD-DP26.1
N$28  (via drill 0.3)
  Top 0.305: R8.1 30.98,5.03 33.03,5.03 34.29,3.77 40.01,3.77 41.26,5.03 SW1.1 | v37.15,18.17 36.58,18.75 35.89,18.75 IC1.25 35.78,18.86 34.4,18.86 33.26,20 v33.03,20
  Bottom 0.305: v37.15,18.17 37.15,9.26 41.26,5.14 SW1.1 | v33.03,20 33.03,21.83 32,22.86 31.77,22.86 26.4,28.23 26.4,33.15 23.66,35.89 23.66,36.8 PAD-DP25.1
N$29
  Bottom 0.406: JP1.1 31.66,47.09 31.66,48.35 28.8,51.21 X1.17 28.69,51.44 27.43,52.69 27.43,54.29 26.63,55.09 7.89,55.09 7.09,54.29 7.09,53.26 8.34,52.01 8.34,51.32 X1.1
N$30
  Top 1.524: Q1.P$2 32.23,40.46 32.23,41.38 29.26,44.35 JP1.4
N$31
  Top 0.305: PAD54.1 13.49,41.83 13.49,39.43 PAD55.1 13.49,39.32 13.49,36.92 PAD56.1 13.49,36.69 13.49,34.4 PAD57.1 13.49,34.29 13.49,31.89 PAD58.1 13.49,31.66 13.49,29.26 PAD59.1 13.49,29.15 13.49,26.75 PAD60.1 13.49,26.63 13.49,24.23 PAD61.1 13.49,24 13.49,21.72 PAD62.1 13.49,21.49 13.49,19.09 PAD63.1 13.49,18.97 13.49,16.57 PAD64.1 13.49,16.46 13.49,14.06 PAD65.1 13.49,13.83 13.49,11.54 PAD66.1 13.49,11.43 13.49,8.91 PAD67.1
N$32
  Top 0.305: PAD70.1 PAD71.1 PAD72.1 PAD73.1 PAD74.1 PAD75.1 PAD76.1 PAD77.1 PAD78.1 PAD79.1 PAD80.1 PAD81.1 PAD82.1 PAD83.1

### Text on the board
tNames: to / RPi | from / RPi | RPi + LPC1114FDH28 ver 1.0.2 / by TareObjects 2016-12-02
tValues: 2SJ681